# Altium schematic sheet Sheet3.SchDoc
size 209 x 297 mm; Scale: 1:1; Номер листа: 1; Общее количество листов: 2; Разраб.: Косяков Д.; Пров.: Гюльмалиев Э.; Утв.: Гюльмалиев Э.; Масштаб: 1:1; Наименование организации: ГБПОУ "1-й МОК"; Наименование изделия 1: Плата пульта ДУ; Наименование изделия 2: Схема электрическая; Наименование изделия 3: принципиальная; Нач. отд.: Науч. рук; Фамилия нач. отд.: Гюльмалиев Э.
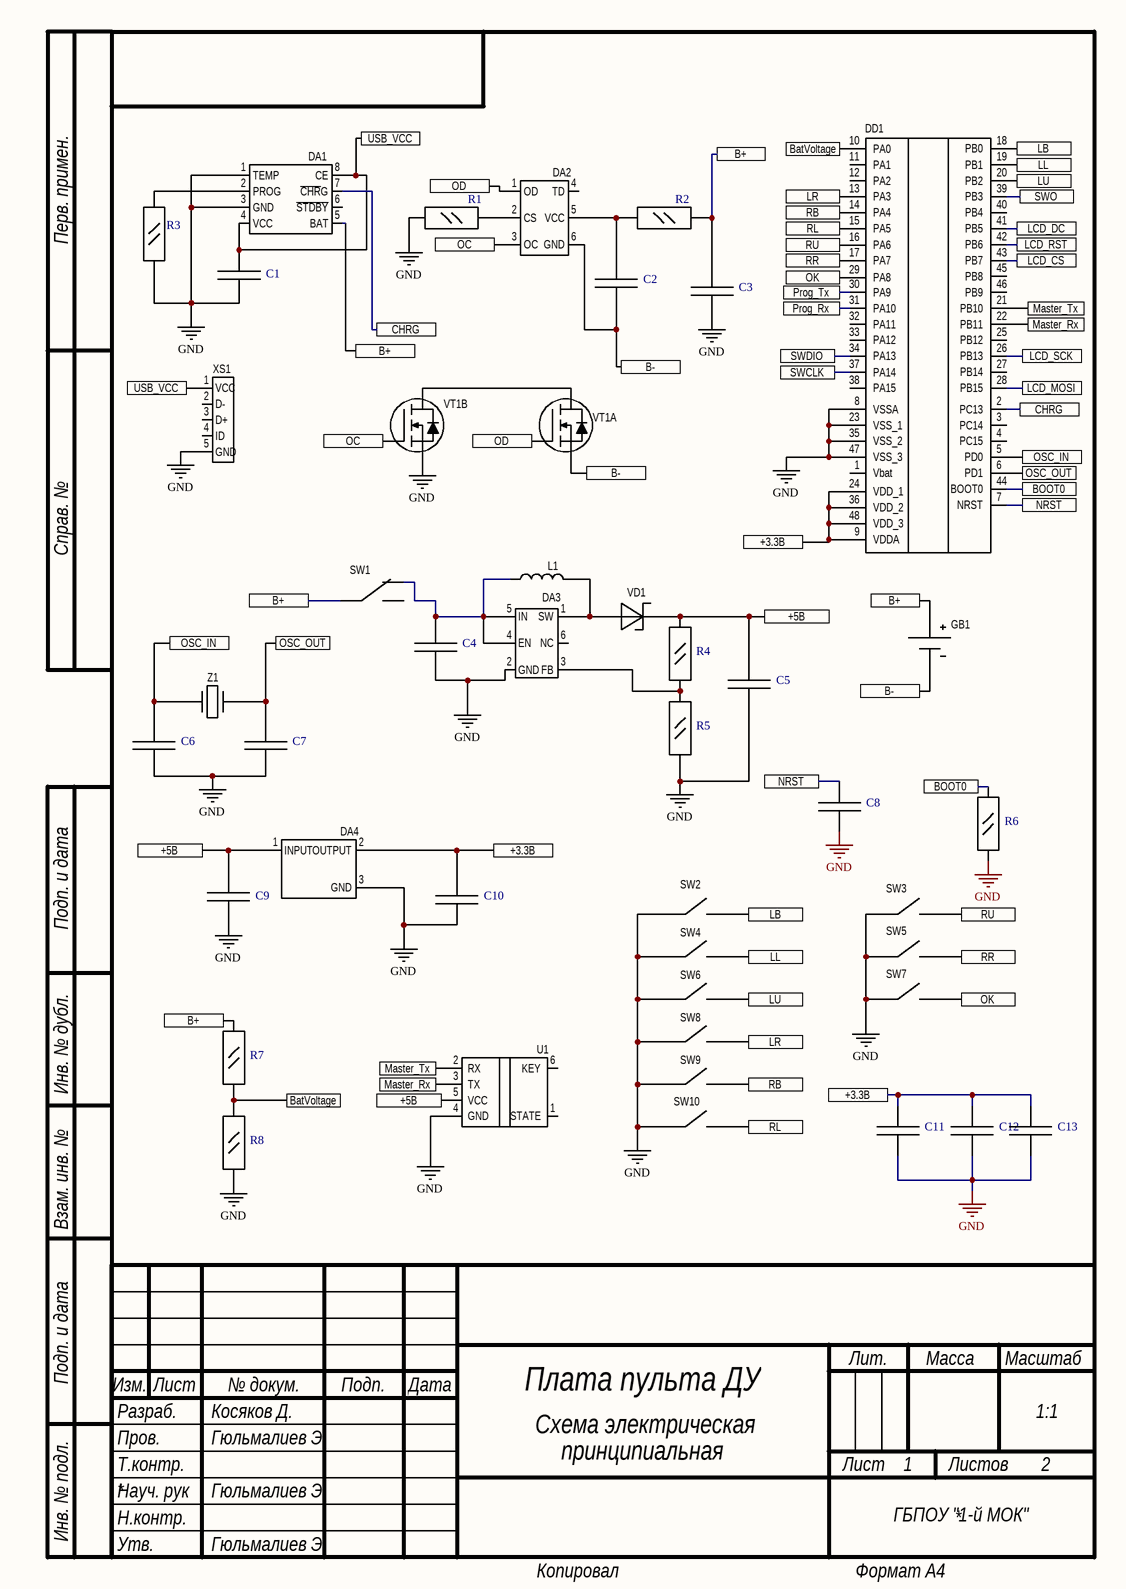
[diagram p0: Sheet3.SchDoc]

## Parts
C1  0.1uF  [CAPC2112X13N]  (value not drawn)
C2  0.1uF  [CAPC2112X13N]  (value not drawn)
C3  10uF  [CAPC2112X13N]  (value not drawn)
C4  22uF  [CAPC2112X13N]  (value not drawn)
C5  22uF  [CAPC2112X13N]  (value not drawn)
C6  22pF  [CAPC2112X13N]  (value not drawn)
C7  22pF  [CAPC2112X13N]  (value not drawn)
C8  0.1uF  [CAPC2112X13N]  (value not drawn)
C9  10uF  [CAPC2112X13N]  (value not drawn)
C10  10uF  [CAPC2112X13N]  (value not drawn)
C11  0.1uF  [CAPC2112X13N]  (value not drawn)
C12  0.1uF  [CAPC2112X13N]  (value not drawn)
C13  0.1uF  [CAPC2112X13N]  (value not drawn)
DA1  TP4056  [SOP127P600X173-8N]  (value not drawn)
DA2  DA?  [SOT-23-6]  (value not drawn)
DA3  MT3608  [SOT-23-6]  (value not drawn)
DA4  NCP1117  [SOT230P700X180-4N]  (value not drawn)
DD1  STM32F103C8T6 (LQFP48)  [TSQFP50P900X900X160-48N]  (value not drawn)
GB1  Batt Li-On  [BATT]  (value not drawn)
L1  22uH  [inductor SMD]  (value not drawn)
R1  1k  [RESC2113X06N]  (value not drawn)
R2  100  [RESC2113X06N]  (value not drawn)
R3  1.2k  [RESC2113X06N]  (value not drawn)
R4  15k  [RESC2113X06N]  (value not drawn)
R5  2k  [RESC2113X06N]  (value not drawn)
R6  100k  [RESC2113X06N]  (value not drawn)
R7  47k  [RESC2113X06N]  (value not drawn)
R8  47k  [RESC2113X06N]  (value not drawn)
SW1  SWITCH  [Switch]  (value not drawn)
SW2  Button  [PCBComponent_1]  (value not drawn)
SW3  Button  [PCBComponent_1]  (value not drawn)
SW4  Button  [PCBComponent_1]  (value not drawn)
SW5  Button  [PCBComponent_1]  (value not drawn)
SW6  Button  [PCBComponent_1]  (value not drawn)
SW7  Button  [PCBComponent_1]  (value not drawn)
SW8  Button  [PCBComponent_1]  (value not drawn)
SW9  Button  [PCBComponent_1]  (value not drawn)
SW10  Button  [PCBComponent_1]  (value not drawn)
U1  HC-05  [HC-05]  (value not drawn)
VD1  SS34  [SS34]  (value not drawn)
VT1  FS8205A(MOSFET,TSSOP-8)  [TSOP65P600X120-8N]  (value not drawn)  (parts A,B of 2)
XS1  USB  [USB_Type2]  (value not drawn)
Z1  Quartz  [HC-49SM]  (value not drawn)

## Ports
+3.3В, +5В, B+, B-, BatVoltage, BOOT0, CHRG, LB, LCD_CS, LCD_DC, LCD_MOSI, LCD_RST, LCD_SCK, LL, LR, LU, Master_Rx, Master_Tx, NRST, OC, OD, OK, OSC_IN, OSC_OUT, Prog_Rx, Prog_Tx, RB, RL, RR, RU, SWCLK, SWDIO, SWO, USB_VCC

## Nets
GND: C1.1 C3.1 C4.1 C5.1 C6.1 C7.1 C8.1 C9.1 C10.1 C11.1 C12.1 C13.1 DA1.1(TEMP) DA1.3(GND) DA3.2(GND) DA4.3(GND) DD1.8(VSSA) DD1.23(VSS_1) DD1.35(VSS_2) DD1.47(VSS_3) R1.2 R3.1 R5.1 R6.1 R8.1 SW2.1 SW3.1 SW4.1 SW5.1 SW6.1 SW7.1 SW8.1 SW9.1 SW10.1 U1.4(GND) VT1.6(S2) XS1.5(GND)
+3.3В: C10.2 C11.2 C12.2 C13.2 DA4.2(OUTPUT) DD1.9(VDDA) DD1.24(VDD_1) DD1.36(VDD_2) DD1.48(VDD_3) ; port +3.3В
+5В: C5.2 C9.2 DA4.1(INPUT) R4.2 U1.5(VCC) VD1.2 ; port +5В
B+: C3.2 DA1.5(BAT) GB1.1 R2.1 R7.2 SW1.1 ; port B+
B-: C2.1 DA2.6(GND) GB1.2 VT1.2(S1) ; port B-
BatVoltage: DD1.10(PA0) R7.1 R8.2 ; port BatVoltage
BOOT0: DD1.44(BOOT0) R6.2 ; port BOOT0
CHRG: DA1.7(~{CHR}G) DD1.2(PC13) ; port CHRG
LB: DD1.18(PB0) SW2.2 ; port LB
LCD_CS: DD1.43(PB7) ; port LCD_CS
LCD_DC: DD1.41(PB5) ; port LCD_DC
LCD_MOSI: DD1.28(PB15) ; port LCD_MOSI
LCD_RST: DD1.42(PB6) ; port LCD_RST
LCD_SCK: DD1.26(PB13) ; port LCD_SCK
LL: DD1.19(PB1) SW4.2 ; port LL
LR: DD1.13(PA3) SW8.2 ; port LR
LU: DD1.20(PB2) SW6.2 ; port LU
Master_Rx: DD1.22(PB11) U1.3(TX) ; port Master_Rx
Master_Tx: DD1.21(PB10) U1.2(RX) ; port Master_Tx
NRST: C8.2 DD1.7(NRST) ; port NRST
OC: DA2.3(OC) VT1.5(G2) ; port OC
OD: DA2.1(OD) VT1.4(G1) ; port OD
OK: DD1.29(PA8) SW7.2 ; port OK
OSC_IN: C6.2 DD1.5(PD0) Z1.1 ; port OSC_IN
OSC_OUT: C7.2 DD1.6(PD1) Z1.2 ; port OSC_OUT
Prog_Rx: DD1.31(PA10) ; port Prog_Rx
Prog_Tx: DD1.30(PA9) ; port Prog_Tx
RB: DD1.14(PA4) SW9.2 ; port RB
RL: DD1.15(PA5) SW10.2 ; port RL
RR: DD1.17(PA7) SW5.2 ; port RR
RU: DD1.16(PA6) SW3.2 ; port RU
SWCLK: DD1.37(PA14) ; port SWCLK
SWDIO: DD1.34(PA13) ; port SWDIO
SWO: DD1.39(PB3) ; port SWO
USB_VCC: C1.2 DA1.4(VCC) DA1.8(CE) XS1.1(VCC) ; port USB_VCC
NetC2_2: C2.2 DA2.5(VCC) R2.2
NetC4_2: C4.2 DA3.4(EN) DA3.5(IN) L1.1 SW1.2
NetDA1_2: DA1.2(PROG) R3.2
NetDA2_2: DA2.2(CS) R1.1
NetDA3_1: DA3.1(SW) L1.2 VD1.1
NetDA3_3: DA3.3(FB) R4.1 R5.2
NetVT1_1: VT1.1(D12) VT1.8(D12)

Not connected (* = marked no-connect by the designer): DA1 6(~{STDBY}); DA2 4(TD); DA3 6(NC); DD1 1(Vbat) 3(PC14) 4(PC15) 11(PA1) 12(PA2) 25(PB12) 27(PB14) 32(PA11) 33(PA12) 38(PA15) 40(PB4) 45(PB8) 46(PB9); SW1 3; U1 1(STATE) 6(KEY); XS1 2(D-) 3(D+) 4(ID)

## Notes on the sheet
- Перв. примен.
- Справ. №
- Подп. и дата
- Инв. № дубл.
- Взам. инв. №
- Разраб.
- Изм.
- Лист
- № докум.
- Подп.
- Дата
- Лит.
- Масса
- Масштаб
- Пров.
- Т.контр.
- Листов
- Инв. № подл.
- Утв.
- Н.контр.
- Копировал
- Формат А4

## Library data of the parts
C3-C7 C9 C10 = 0.1uF
DA2 = DW01A
DA3 = MT3608: DC-DC Up converter (SOT23-6)
L1 = Inductor
R1-R8 = Резистор 0805
VD1 = SS34: Диод Шоттки 3A 40V
VT1 = FS8205A(MOSFET,TSSOP-8): N-Channel MOSFET TSSOP-8